# Altium schematic sheet digital_host_for_ADS1216_main.SchDoc
size 420 x 297 mm; Address1: Address1; Address2: Address2; Address3: Address3; Address4: Address4; SheetNumber: 1; Scale: 1:1; Разраб.: Иванов; Обозначение документа: АБВГ.123456.001 Э3; Пров.: Петров; Утв.: Сидоров; Наименование организации: ОАО "Концерн "МПО-Гидроприбор"; Перв. применение: АБВГ.123456.000; Наименование изделия 1: Плата; Наименование изделия 2: Схема электрическая; Наименование изделия 3: принципиальная; Нач. отд.: Нач. отд.; Фамилия нач. отд.: Сидоров
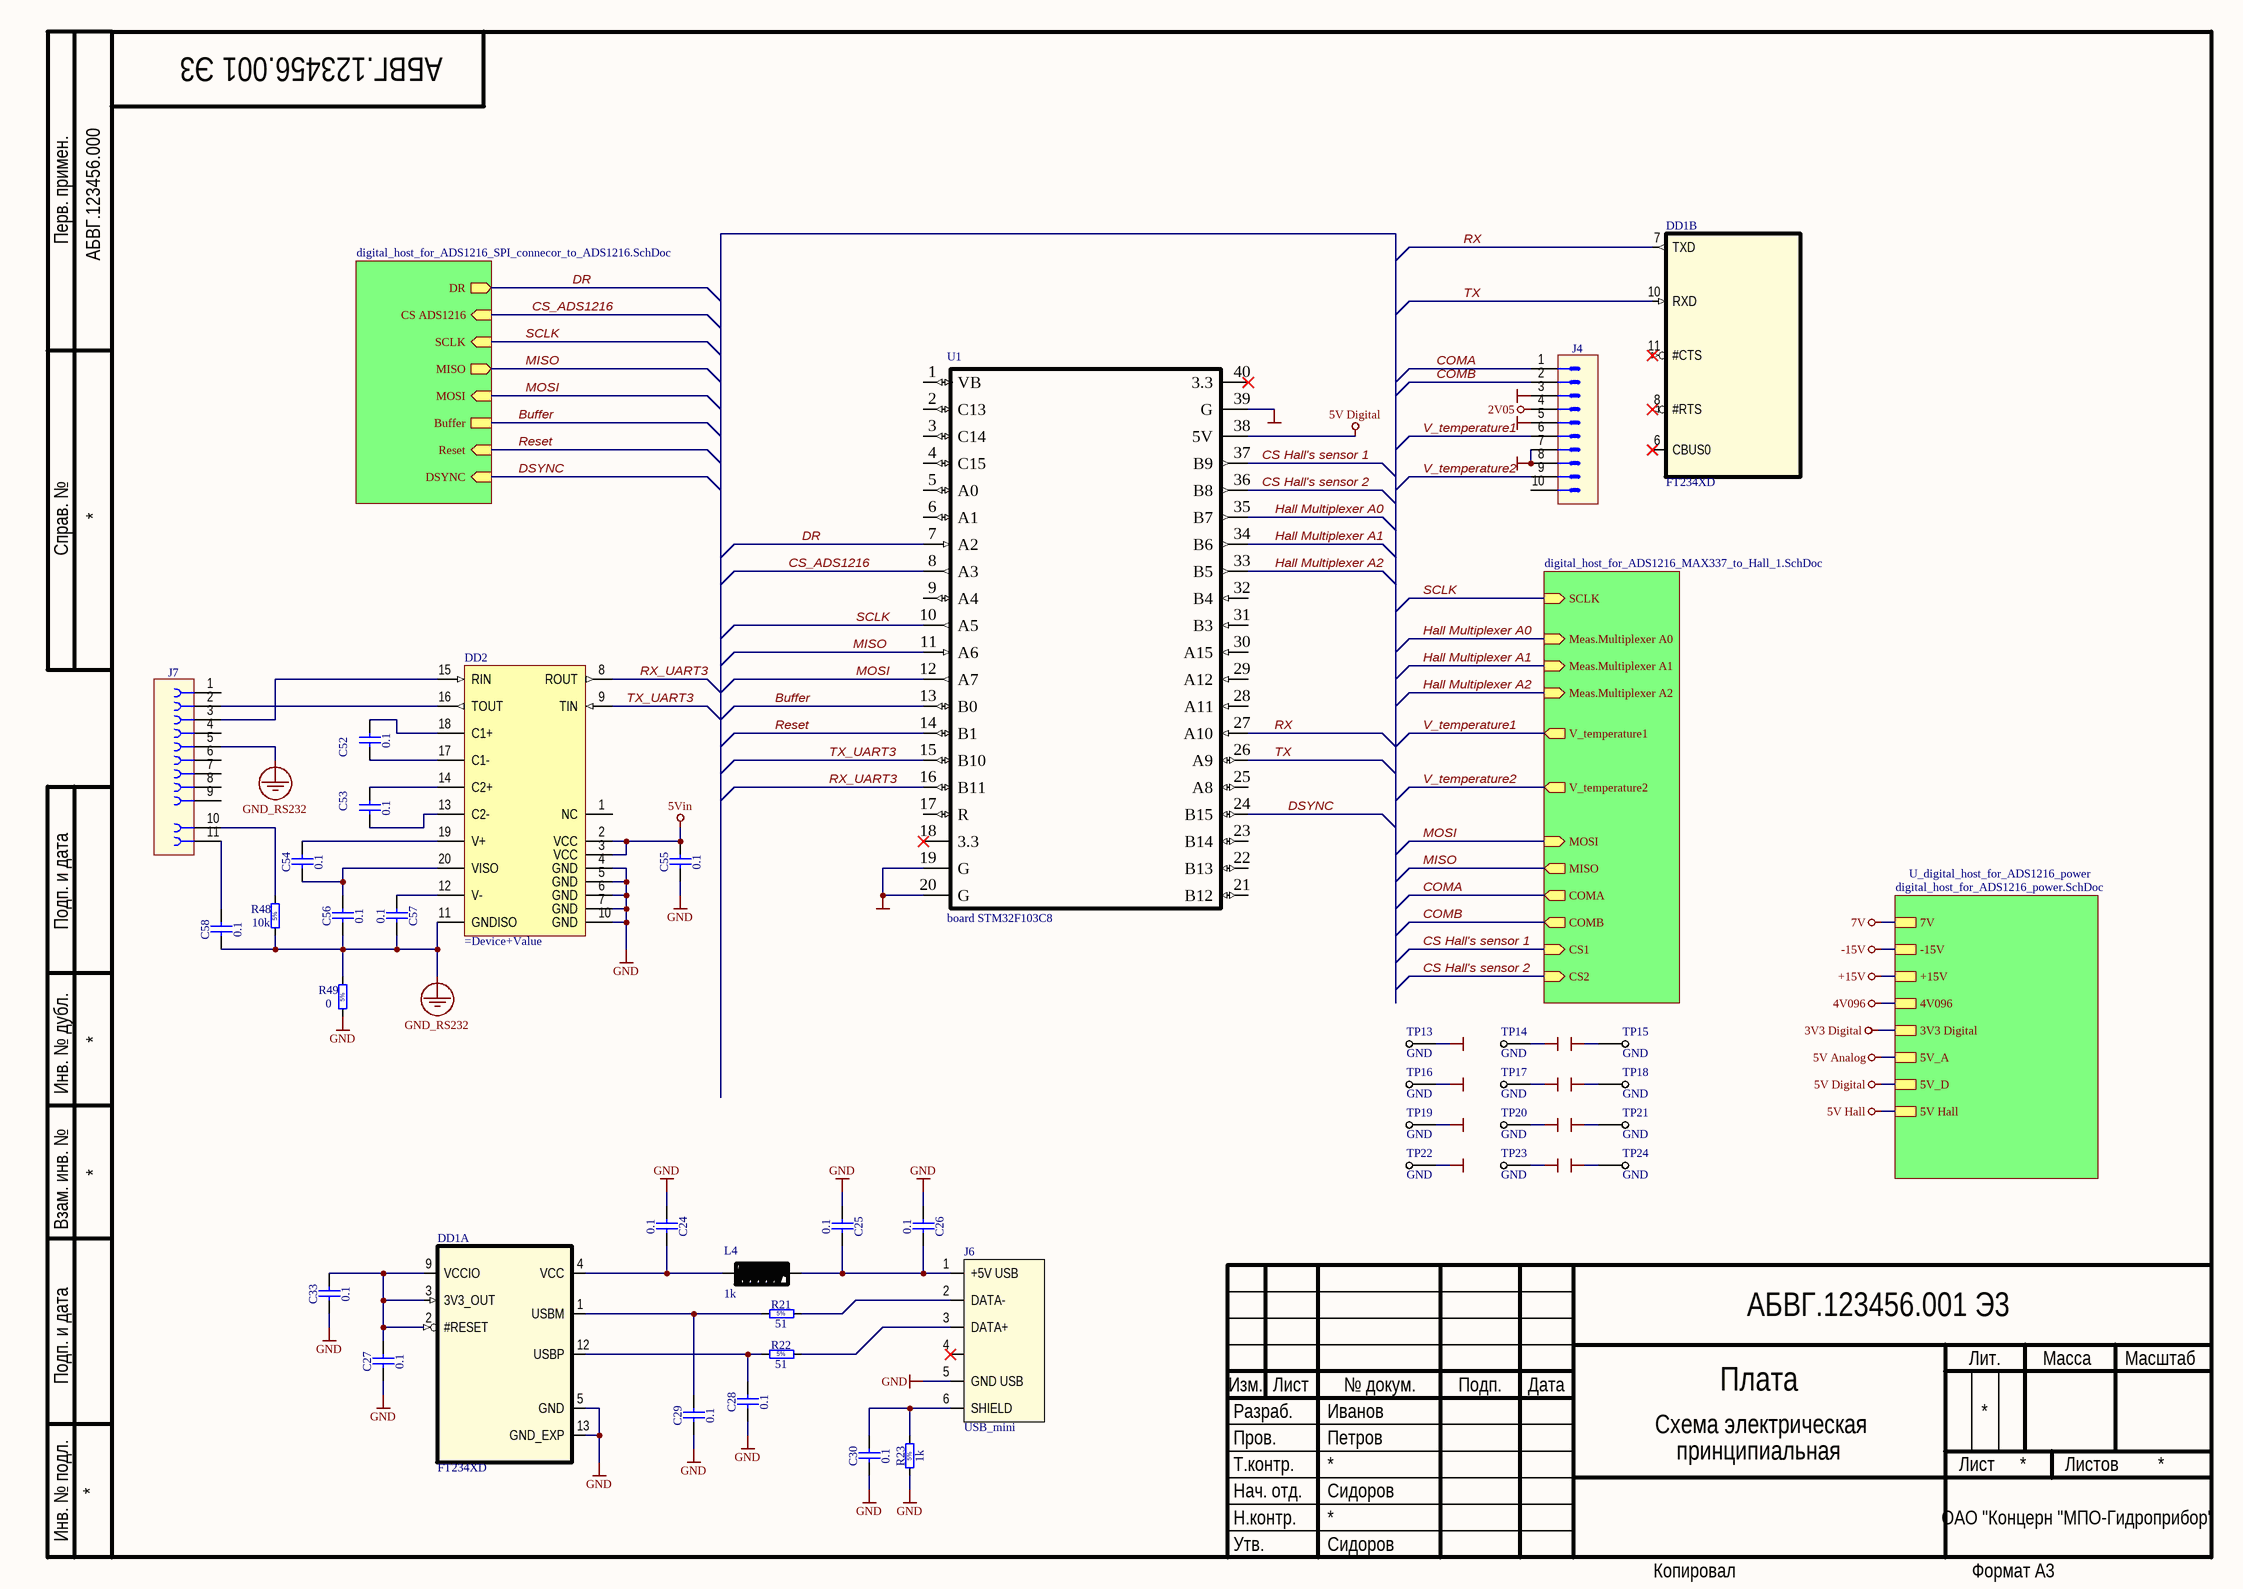
[diagram p0: digital_host_for_ADS1216_main.SchDoc]

## Parts
C24  0.1  [CAPC2012X90N]
C25  0.1  [CAPC2012X90N]
C26  0.1  [CAPC2012X90N]
C27  0.1  [CAPC2012X90N]
C28  0.1  [CAPC2012X90N]
C29  0.1  [CAPC2012X90N]
C30  0.1  [CAPC2012X90N]
C33  0.1  [CAPC2012X90N]
C52  0.1  [CAPC2012X90N]
C53  0.1  [CAPC2012X90N]
C54  0.1  [CAPC2012X90N]
C55  0.1  [CAPC2012X90N]
C56  0.1  [CAPC2012X90N]
C57  0.1  [CAPC2012X90N]
C58  0.1  [CAPC2012X90N]
DD1  FT234XD  [DFN_12-045]  (parts A,B of 2)
DD2  (no value)  [SOIC127P1032X265-20N]
J4  (no value)  [3M_N2510-6002RB]
J6  USB_mini  [TYCO_1734035-1]
J7  (no value)  [TYCO_5747844-5]
L4  1k  [RESC2012X50N]
R21  51  [RESC2012X70N]
R22  51  [RESC2012X70N]
R23  1k  [RESC2012X70N]
R48  10k  [RESC2012X70N]
R49  0  [RESC2012X70N]
TP13  GND  [TP1]
TP14  GND  [TP1]
TP15  GND  [TP1]
TP16  GND  [TP1]
TP17  GND  [TP1]
TP18  GND  [TP1]
TP19  GND  [TP1]
TP20  GND  [TP1]
TP21  GND  [TP1]
TP22  GND  [TP1]
TP23  GND  [TP1]
TP24  GND  [TP1]
U1  board STM32F103C8  [blue_pill]

## Sub-sheets
connector to SPI ADS = digital_host_for_ADS1216_SPI_connecor_to_ADS1216.SchDoc: DR (out), CS ADS1216 (in), SCLK (in), MISO (out), MOSI (in), Buffer, Reset (in), DSYNC (in)
multiplexer = digital_host_for_ADS1216_MAX337_to_Hall_1.SchDoc: Meas.Multiplexer A0 (in), Meas.Multiplexer A1 (in), Meas.Multiplexer A2 (in), COMA (out), COMB (out), V_temperature1 (out), V_temperature2 (out), MOSI (in), MISO (out), CS1 (in), CS2 (in), SCLK (in)
U_digital_host_for_ADS1216_power = digital_host_for_ADS1216_power.SchDoc: 7V, -15V, +15V, 4V096, 3V3 Digital, 5V_A, 5V_D, 5V Hall

## Nets
2V05: J4.4
3V3 Digital: sheet U_digital_host_for_ADS1216_power/3V3 Digital
4V096: sheet U_digital_host_for_ADS1216_power/4V096
5V Analog: sheet U_digital_host_for_ADS1216_power/5V_A
5V Digital: U1.38(5V) ; sheet U_digital_host_for_ADS1216_power/5V_D
5V Hall: sheet U_digital_host_for_ADS1216_power/5V Hall
5Vin: C55.1 DD2.2(VCC) DD2.3(VCC)
7V: sheet U_digital_host_for_ADS1216_power/7V
+15V: sheet U_digital_host_for_ADS1216_power/+15V
-15V: sheet U_digital_host_for_ADS1216_power/-15V
GND: C24.1 C25.1 C26.1 C27.1 C28.1 C29.1 C30.1 C33.1 C55.2 DD1.5(GND) DD1.13(GND_EXP) DD2.4(GND) DD2.5(GND) DD2.6(GND) DD2.7(GND) DD2.10(GND) J4.3 J4.5 J4.7 J4.8 J6.5(GND_USB) R23.1 R49.1 TP13.1(P) TP14.1(P) TP15.1(P) TP16.1(P) TP17.1(P) TP18.1(P) TP19.1(P) TP20.1(P) TP21.1(P) TP22.1(P) TP23.1(P) TP24.1(P) U1.19(G) U1.20(G) U1.39(G)
GND_RS232: C56.2 C57.1 C58.2 DD2.11(GNDISO) J7.5 R48.1 R49.2
Buffer: U1.13(B0) ; sheet connector to SPI ADS/Buffer
COMA: J4.1 ; sheet multiplexer/COMA
COMB: J4.2 ; sheet multiplexer/COMB
CS Hall's sensor 1: U1.37(B9) ; sheet multiplexer/CS1
CS Hall's sensor 2: U1.36(B8) ; sheet multiplexer/CS2
CS_ADS1216: U1.8(A3) ; sheet connector to SPI ADS/CS ADS1216
DR: U1.7(A2) ; sheet connector to SPI ADS/DR
DSYNC: U1.24(B15) ; sheet connector to SPI ADS/DSYNC
Hall Multiplexer A0: U1.35(B7) ; sheet multiplexer/Meas.Multiplexer A0
Hall Multiplexer A1: U1.34(B6) ; sheet multiplexer/Meas.Multiplexer A1
Hall Multiplexer A2: U1.33(B5) ; sheet multiplexer/Meas.Multiplexer A2
MISO: U1.11(A6) ; sheet connector to SPI ADS/MISO, sheet multiplexer/MISO
MOSI: U1.12(A7) ; sheet connector to SPI ADS/MOSI, sheet multiplexer/MOSI
Reset: U1.14(B1) ; sheet connector to SPI ADS/Reset
RX: DD1.7(TXD) U1.27(A10)
RX_UART3: DD2.8(ROUT) U1.16(B11)
SCLK: U1.10(A5) ; sheet connector to SPI ADS/SCLK, sheet multiplexer/SCLK
TX: DD1.10(RXD) U1.26(A9)
TX_UART3: DD2.9(TIN) U1.15(B10)
V_temperature1: J4.6 ; sheet multiplexer/V_temperature1
V_temperature2: J4.9 ; sheet multiplexer/V_temperature2
NetC24_2: C24.2 DD1.4(VCC) L4.1
NetC25_2: C25.2 C26.2 J6.1(+5V_USB) L4.2
NetC27_2: C27.2 C33.2 DD1.2(#RESET) DD1.3(3V3_OUT) DD1.9(VCCIO)
NetC28_2: C28.2 DD1.12(USBP) R22.1
NetC29_2: C29.2 DD1.1(USBM) R21.1
NetC30_2: C30.2 J6.6(SHIELD) R23.2
NetC52_1: C52.1 DD2.18(C1+)
NetC52_2: C52.2 DD2.17(C1-)
NetC53_1: C53.1 DD2.14(C2+)
NetC53_2: C53.2 DD2.13(C2-)
NetC54_1: C54.1 DD2.19(V+)
NetC54_2: C54.2 C56.1 DD2.20(VISO)
NetC57_2: C57.2 DD2.12(V-)
NetC58_1: C58.1 J7.11
NetDD2_15: DD2.15(RIN) J7.3
NetDD2_16: DD2.16(TOUT) J7.2
NetJ6_2: J6.2(DATA-) R21.2
NetJ6_3: J6.3(DATA+) R22.2
NetJ7_10: J7.10 R48.2

Not connected (* = marked no-connect by the designer): DD1 6(CBUS0)* 8(#RTS)* 11(#CTS)*; DD2 1(NC); J4 10; J6 4*; J7 1 4 6 7 8 9; U1 1(VB) 2(C13) 3(C14) 4(C15) 5(A0) 6(A1) 9(A4) 17(R) 18(3.3)* 21(B12) 22(B13) 23(B14) 25(A8) 28(A11) 29(A12) 30(A15) 31(B3) 32(B4) 40(3.3)*

## Notes on the sheet
- Перв. примен.
- Справ. №
- Подп. и дата
- Инв. № дубл.
- Взам. инв. №
- Разраб.
- Изм.
- Лист
- № докум.
- Подп.
- Дата
- Лит.
- Масса
- Масштаб
- Пров.
- Т.контр.
- Листов
- Инв. № подл.
- Утв.
- Н.контр.
- Копировал
- Формат А3

## Library data of the parts
C24-C30 C33 C52-C58 = Capacitor - non polarized: Non-polarised capacitor2012; SolderOption: 0; SMD Solders: 2; Dielectric type: X5R; Vendor: any; Value: 0.1; THD Solders: 0
DD1 = FT234XD: USB-UART driver; Vendor: FTDI; SMD Solders: 7; THD Solders: 0; Device: FT234XD; Package: DFN_12-0.45; Unit Price: 2
DD2 = ADM3251: Driver UART-RS232; Vendor: Analog Devices; SMD Solder: 20; THD Solder: 0; Unit_Price: 1200; Device: ADM3251; Unit Price: 6; Package: SOICW20; SolderOption: 0
J4 = Connector 10 Male: THD Solders: 10; SMD Solders: 0; Solder Option: *; Value: *; Vendor: *
J6 = USB_mini: Вилка  PLS 6x2.54; Vendor: TE Connectivity; SolderOption: Norm; Price: 50; Value: USB_mini
J7 = Connector 9 Female: Solder Option: 0; THD Solders: 11; SMD Solders: 0; Vendor: *; Value: *
L4 = BLM21: SMD Ferrite bead 0805; Vendor: Vishay; Unit Price: 0.1; Device: BLM21; Package: SMD0805; Value: 1k
R21 R22 R48 = Resistor - 5%: Vendor: any; SMD Solders: 2; THD Solders: 0; TK: 100ppmC^(-1); SolderOption: 0; Tolerance: 5%
  R21 R22: Value: 51
  R48: Value: 10k
R23 = Resistor - 5%: Vendor: any; SMD Solders: 2; THD Solders: 0; TK: 1000ppmC^(-1); Value: 1k; SolderOption: 0; Tolerance: 5%
R49 = Resistor - 5%: Vendor: any; SMD Solders: 2; TK: 100ppmC^(-1); THD Solders: 0; Value: 0; SolderOption: 0; Tolerance: 5%
TP13-TP24 = TP: Контрольная точка; Vendor: PCB; Price: 0; Value: GND; SolderOption: PCB
U1 = Blue Pill: Blue Pill board; Vendor: STM; Pkg: DIP40; SMD Solders: 0; THD Solders: 40; Value: STM32; SolderOption: 0